# Altium schematic sheet SCH_ZCD_TRIAC.SchDoc
size A4
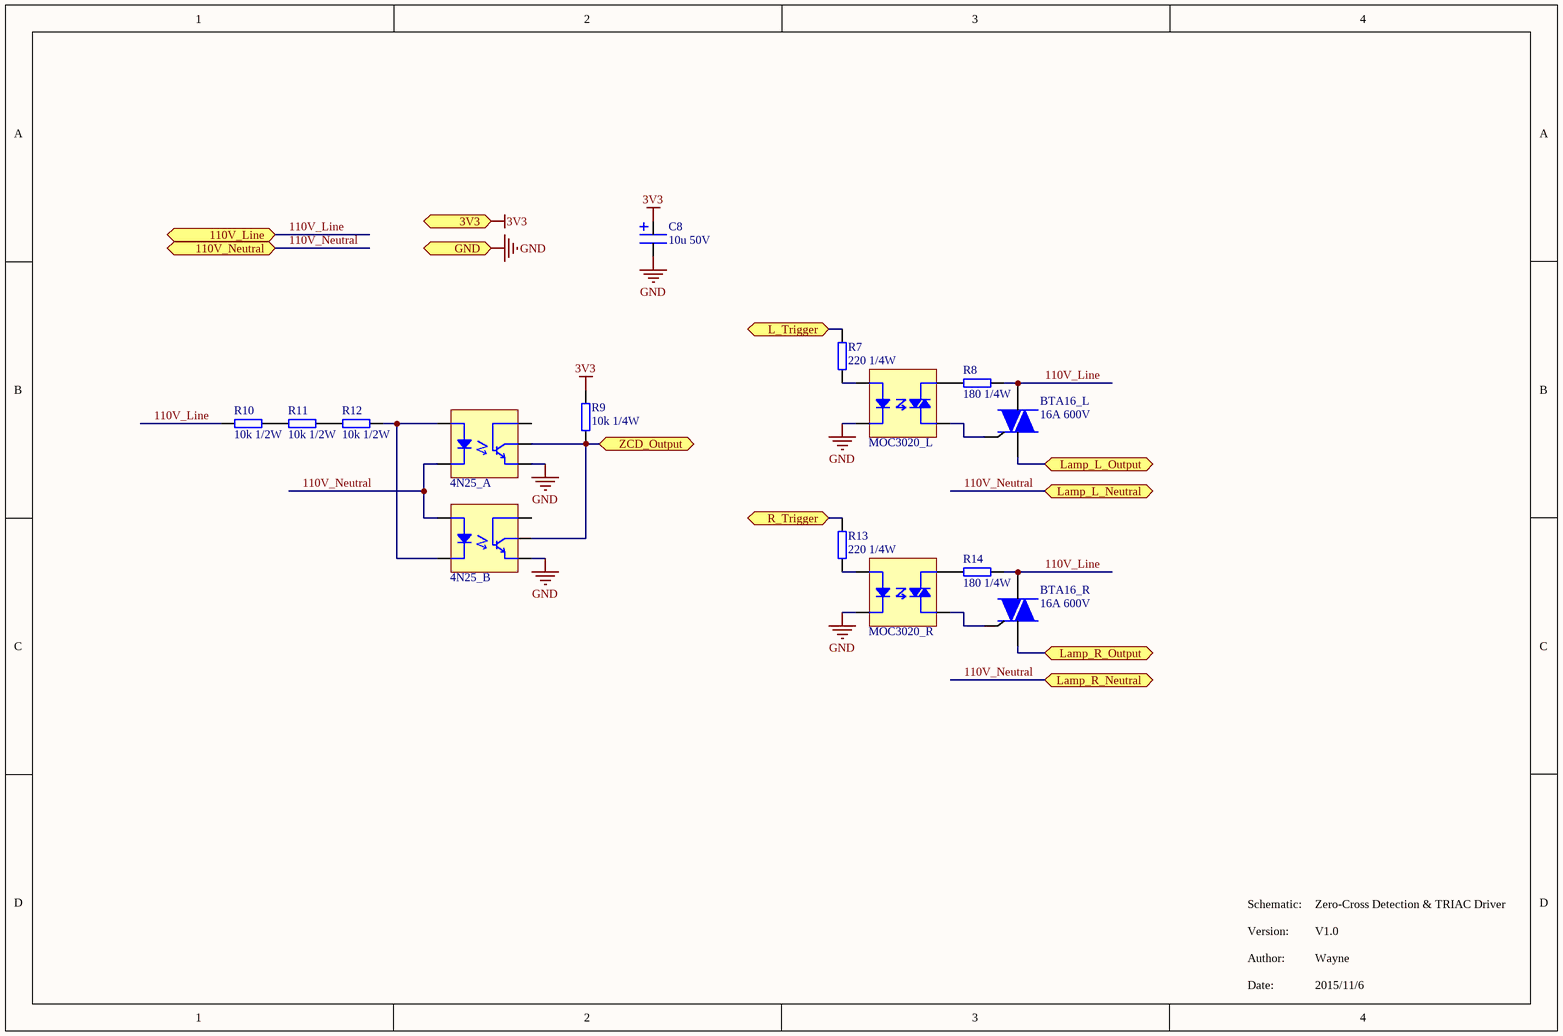
[diagram p0: SCH_ZCD_TRIAC.SchDoc]

## Parts
4N25_A  4N25  [DIP6]  (value not drawn)
4N25_B  4N25  [DIP6]  (value not drawn)
BTA16_L  value 16A 600V  [TO220]  (hidden comment: BTA16)
BTA16_R  value 16A 600V  [TO220]  (hidden comment: BTA16)
C8  value 10u 50V  [CAP Axial 5mm]  (hidden comment: Cap)
MOC3020_L  MOC3020  [DIP6]  (value not drawn)
MOC3020_R  MOC3020  [DIP6]  (value not drawn)
R7  value 220 1/4W  [1/4W Res]  (hidden comment: Res)
R8  value 180 1/4W  [1/4W Res]  (hidden comment: Res)
R9  value 10k 1/4W  [1/4W Res]  (hidden comment: Res)
R10  value 10k 1/2W  [1/2W Res]  (hidden comment: Res)
R11  value 10k 1/2W  [1/2W Res]  (hidden comment: Res)
R12  value 10k 1/2W  [1/2W Res]  (hidden comment: Res)
R13  value 220 1/4W  [1/4W Res]  (hidden comment: Res)
R14  value 180 1/4W  [1/4W Res]  (hidden comment: Res)

## Ports
3V3, 110V_Line, 110V_Neutral, GND, L_Trigger, Lamp_L_Neutral, Lamp_L_Output, Lamp_R_Neutral, Lamp_R_Output, R_Trigger, ZCD_Output

## Nets
3V3: C8.2 R9.2 ; port 3V3
GND: 4N25_A.4(Emitter) 4N25_B.4(Emitter) C8.1 MOC3020_L.2(CATHODE) MOC3020_R.2(CATHODE) ; port GND
110V_Line: BTA16_L.2(A2) BTA16_R.2(A2) R8.1 R10.1 R14.1 ; port 110V_Line
110V_Neutral: 4N25_A.2(CATHODE) 4N25_B.1(ANODE) ; port 110V_Neutral, port Lamp_L_Neutral, port Lamp_R_Neutral
L_Trigger: R7.2 ; port L_Trigger
Lamp_L_Output: BTA16_L.1(A1) ; port Lamp_L_Output
Lamp_R_Output: BTA16_R.1(A1) ; port Lamp_R_Output
R_Trigger: R13.2 ; port R_Trigger
ZCD_Output: 4N25_A.5(Collector) 4N25_B.5(Collector) R9.1 ; port ZCD_Output
Net4N25_A_1: 4N25_A.1(ANODE) 4N25_B.2(CATHODE) R12.2
NetBTA16_L_3: BTA16_L.3(G) MOC3020_L.4(Term2)
NetBTA16_R_3: BTA16_R.3(G) MOC3020_R.4(Term2)
NetMOC3020_L_1: MOC3020_L.1(ANODE) R7.1
NetMOC3020_L_6: MOC3020_L.6(Term1) R8.2
NetMOC3020_R_1: MOC3020_R.1(ANODE) R13.1
NetMOC3020_R_6: MOC3020_R.6(Term1) R14.2
NetR10_2: R10.2 R11.1
NetR11_2: R11.2 R12.1

Not connected (* = marked no-connect by the designer): 4N25_A 6(Base); 4N25_B 6(Base)

## Notes on the sheet
- Zero-Cross Detection & TRIAC Driver
- Schematic:
  Version:
  Author:
  Date:
- Wayne
- V1.0
- 2015/11/6

## Library data of the parts
4N25_A 4N25_B = 4N25: 4N25 Opto Coupler
BTA16_L BTA16_R = BTA16: BTA16 Insulated TRIAC 16A
C8 = Axial Cap
MOC3020_L MOC3020_R = MOC3020: MOC3020 Random Phase Triac Driver
R7-R14 = Axial Resistor